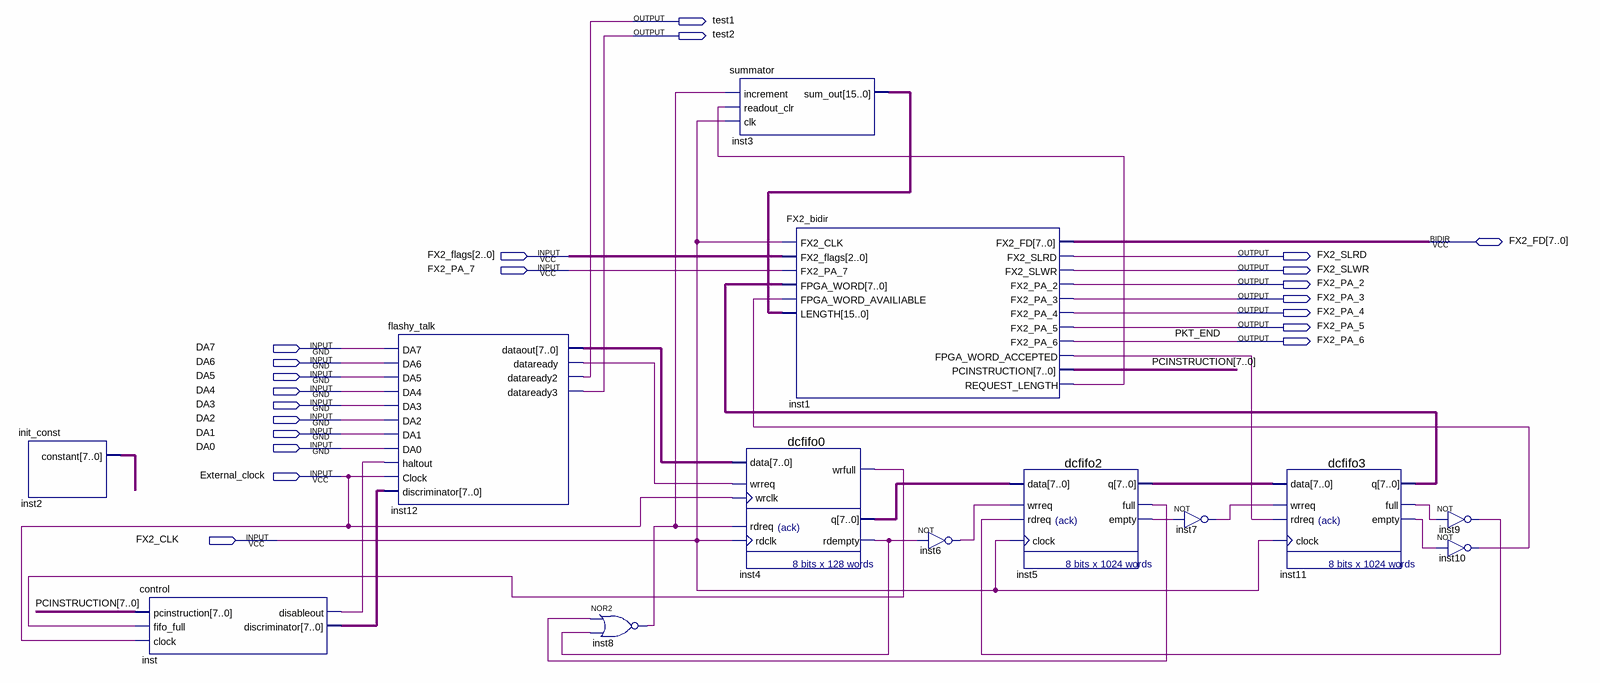
[diagram p0: schematic sheet]
// Quartus schematic testingigo_all.bdf as structural Verilog: 13 symbols, 22 pins
module testingigo_all (
  input  [2:0] FX2_flags,
  input  FX2_PA_7,
  input  DA7,
  input  DA6,
  input  DA5,
  input  DA4,
  input  DA3,
  input  DA2,
  input  DA1,
  input  DA0,
  input  External_clock,
  input  FX2_CLK,
  inout  [7:0] FX2_FD,
  output test1,
  output test2,
  output FX2_SLRD,
  output FX2_SLWR,
  output FX2_PA_2,
  output FX2_PA_3,
  output FX2_PA_4,
  output FX2_PA_5,
  output FX2_PA_6
);

  wire inst1_fpga_word_accepted, inst1_request_length, inst4_rdempty, inst4_wrfull, inst5_empty, inst5_full,
       inst6_out, inst7_out, inst8_out, inst9_out, inst10_out, inst11_empty, inst11_full, inst12_dataready,
       inst_disableout;
  wire [7:0] inst2_constant, inst4_q, inst5_q, inst11_q, inst12_dataout, inst_discriminator, PCINSTRUCTION;
  wire [15:0] inst3_sum_out;

  init_const inst2 (.constant(inst2_constant));
  control inst (
    .pcinstruction(PCINSTRUCTION), .fifo_full(inst4_wrfull), .clock(External_clock),
    .disableout(inst_disableout), .discriminator(inst_discriminator));
  flashy_talk inst12 (
    .DA7(DA7), .DA6(DA6), .DA5(DA5), .DA4(DA4), .DA3(DA3), .DA2(DA2), .DA1(DA1), .DA0(DA0),
    .haltout(inst_disableout), .Clock(External_clock), .discriminator(inst_discriminator),
    .dataout(inst12_dataout), .dataready(inst12_dataready), .dataready2(test1), .dataready3(test2));
  nor inst8 (inst8_out, inst5_full, inst4_rdempty);
  summator inst3 (.increment(inst8_out), .readout_clr(inst1_request_length), .clk(FX2_CLK), .sum_out(inst3_sum_out));
  FX2_bidir inst1 (
    .FX2_CLK(FX2_CLK), .FX2_flags(FX2_flags), .FX2_PA_7(FX2_PA_7), .FPGA_WORD(inst11_q),
    .FPGA_WORD_AVAILIABLE(inst10_out), .LENGTH(inst3_sum_out), .FX2_SLRD(FX2_SLRD), .FX2_SLWR(FX2_SLWR),
    .FX2_PA_2(FX2_PA_2), .FX2_PA_3(FX2_PA_3), .FX2_PA_4(FX2_PA_4), .FX2_PA_5(FX2_PA_5), .FX2_PA_6(FX2_PA_6),
    .FPGA_WORD_ACCEPTED(inst1_fpga_word_accepted), .PCINSTRUCTION(PCINSTRUCTION),
    .REQUEST_LENGTH(inst1_request_length), .FX2_FD(FX2_FD));
  dcfifo0 inst4 (
    .data(inst12_dataout), .wrreq(inst12_dataready), .wrclk(External_clock), .rdreq(inst8_out),
    .rdclk(FX2_CLK), .wrfull(inst4_wrfull), .q(inst4_q), .rdempty(inst4_rdempty));
  not inst6 (inst6_out, inst4_rdempty);
  dcfifo2 inst5 (
    .data(inst4_q), .wrreq(inst6_out), .rdreq(inst9_out), .clock(FX2_CLK), .q(inst5_q), .full(inst5_full),
    .empty(inst5_empty));
  not inst7 (inst7_out, inst5_empty);
  dcfifo3 inst11 (
    .data(inst5_q), .wrreq(inst7_out), .rdreq(inst1_fpga_word_accepted), .clock(FX2_CLK), .q(inst11_q),
    .full(inst11_full), .empty(inst11_empty));
  not inst9 (inst9_out, inst11_full);
  not inst10 (inst10_out, inst11_empty);

  // Other names for the same wires on the sheet: PKT_END = FX2_PA_6
endmodule
